# EAGLE design Stanford Metro Mini (EAGLE 8.2.2)
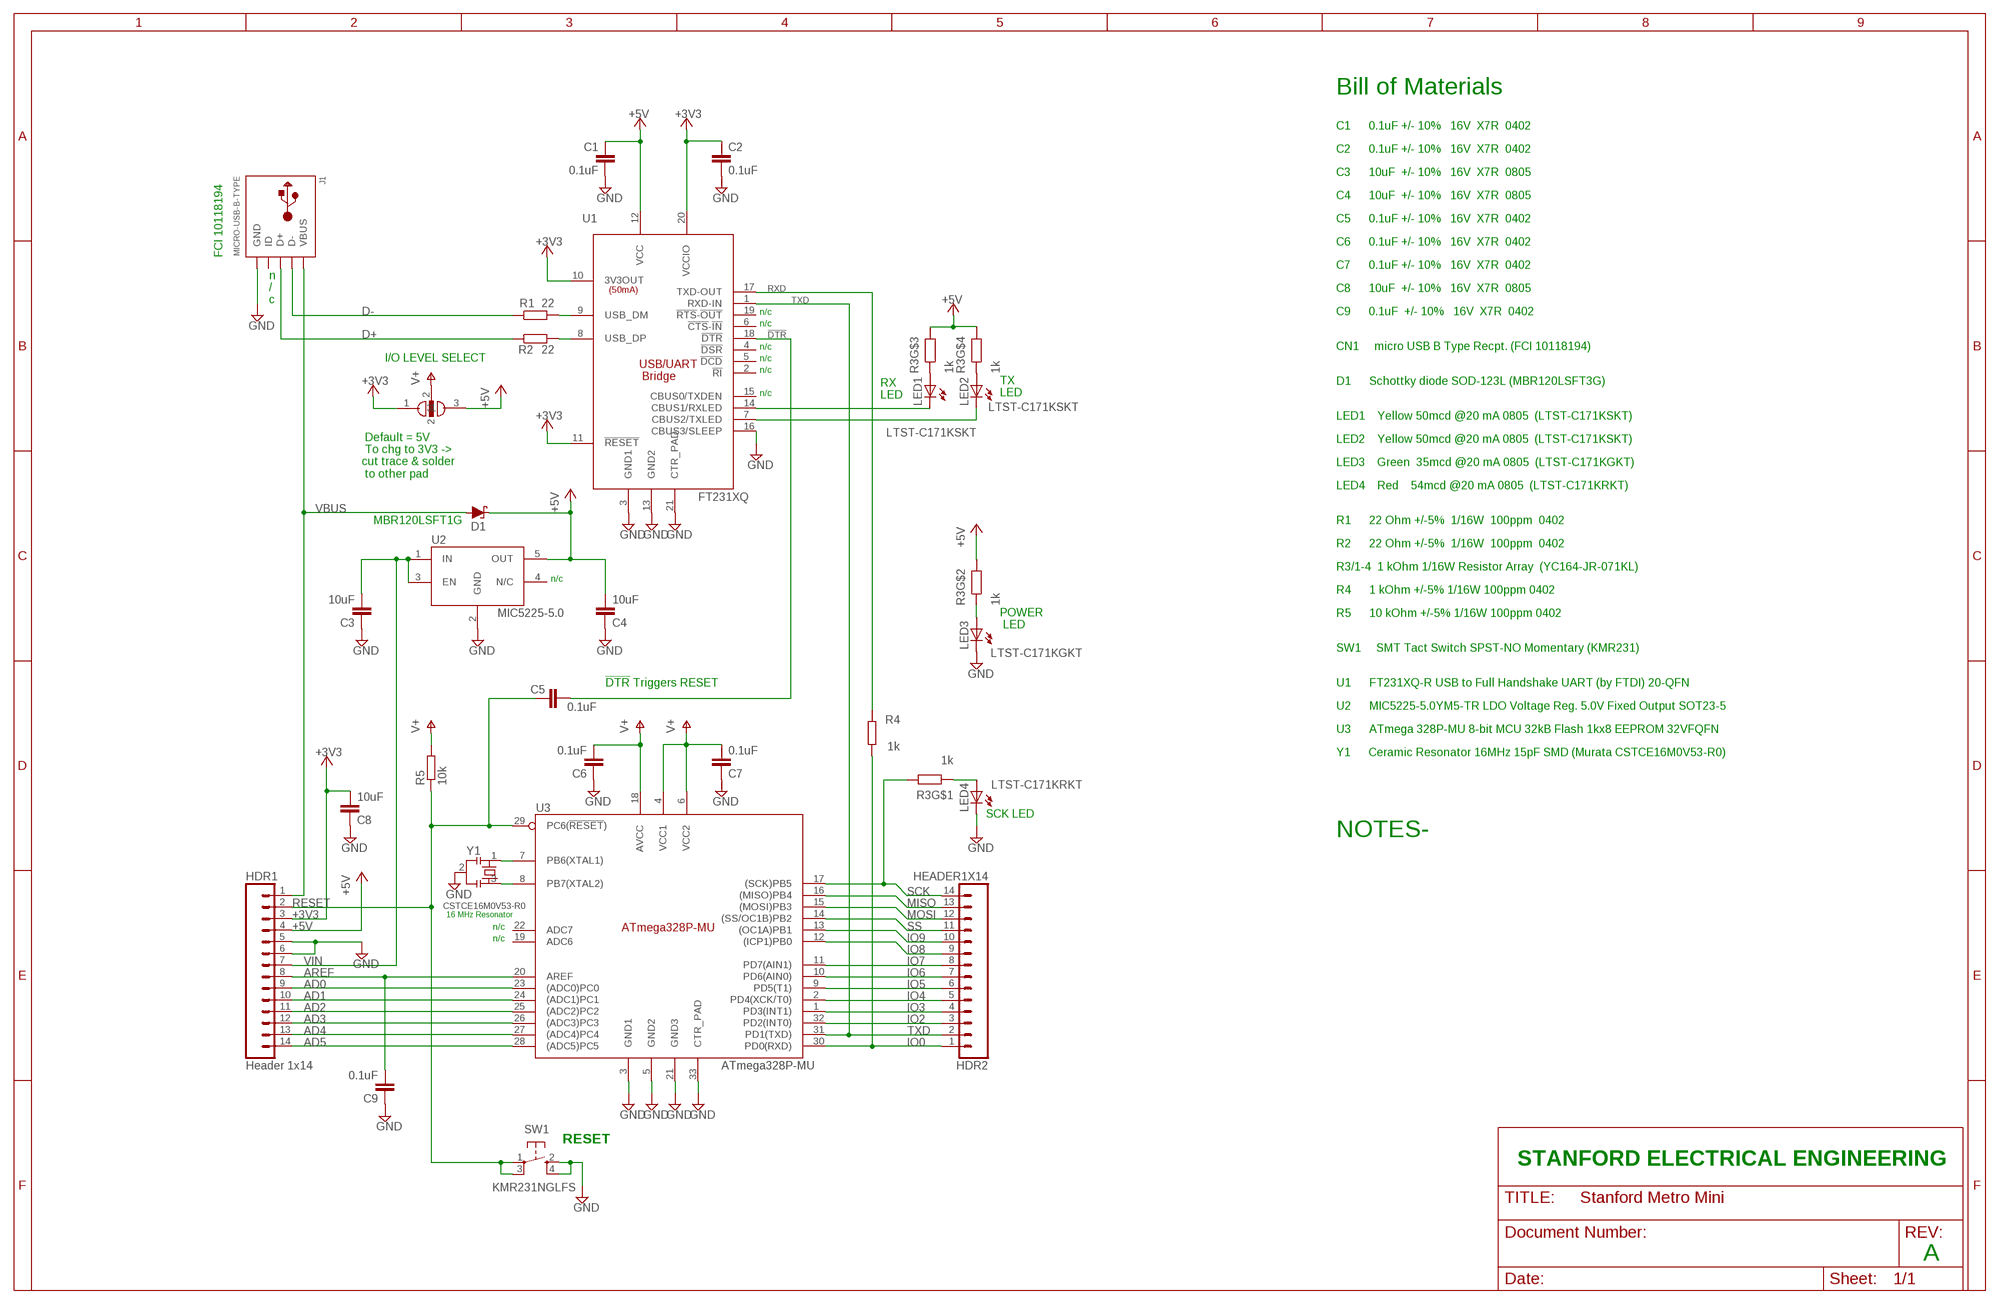
[diagram p0: schematic, sheet 1]

## Parts
C1  0.1uF  C-EUC0402  [C0402]
C2  0.1uF  C-EUC0402  [C0402]
C3  10uF  C-EUC0805  [C0805]
C4  10uF  C-EUC0805  [C0805]
C5  0.1uF  C-EUC0402  [C0402]
C6  0.1uF  C-EUC0402  [C0402]
C7  0.1uF  C-EUC0402  [C0402]
C8  10uF  C-EUC0805  [C0805]
C9  0.1uF  C-EUC0402  [C0402]
D1  SCHOTTKY  [SOD123]
HDR1  Header 1x14  HEADER1X14  [1X14]
HDR2  HEADER1X14  [1X14]
J1  MICRO-USB-B-TYPE  [10118194-MICRO-USB]
LED1  LTST-C171KSKT  LEDCHIPLED_0805  [CHIPLED_0805]
LED2  LTST-C171KSKT  LEDCHIPLED_0805  [CHIPLED_0805]
LED3  LTST-C171KGKT  LEDCHIPLED_0805  [CHIPLED_0805]
LED4  LTST-C171KRKT  LEDCHIPLED_0805  [CHIPLED_0805]
R1  22  R-EU_R0402  [R0402]
R2  22  R-EU_R0402  [R0402]
R3  1k  R-ARRAY  [R-ARRAY]
R4  1k  R-EU_R0402  [R0402]
R5  10k  R-EU_R0402  [R0402]
SW1  KMR231NGLFS  SPST_TACT-KMR2  [KMR2]
U1  FT231XQ  [QFN20]
U2  MIC5225-5.0  [SOT23-5]
U3  ATmega328P-MU  ATMEGA328P-MU  [VQFN-32_CTR-PAD]
U$1  V_SELECT  [V_SELECT]
Y1  CSTCE16M0V53-R0  CSTCE  [CSTCE]

## Nets
!DTR: C5.2 U1.18(!DTR!)
+3V3: C2.1 C8.2 HDR1.3 U1.10(3V3OUT) U1.11(!RESET!) U1.20(VCCIO) U$1.1
+5V: C1.1 C4.2 D1.1(C) HDR1.4 R3.2B(B) R3.3B(B) R3.4B(B) U1.12(VCC) U2.5(OUT) U$1.3
AD0: HDR1.9 U3.23((ADC0)PC0)
AD1: HDR1.10 U3.24((ADC1)PC1)
AD2: HDR1.11 U3.25((ADC2)PC2)
AD3: HDR1.12 U3.26((ADC3)PC3)
AD4: HDR1.13 U3.27((ADC4)PC4)
AD5: HDR1.14 U3.28((ADC5)PC5)
AREF: C9.2 HDR1.8 U3.20(AREF)
D+: J1.3(D+) R2.1
D-: J1.2(D-) R1.1
GND: C1.2 C2.2 C3.1 C4.1 C6.1 C7.1 C8.1 C9.1 HDR1.5 HDR1.6 J1.5(GND) LED3.C LED4.C SW1.2(S) SW1.4(S1) U1.3(GND1) U1.13(GND2) U1.16(CBUS3/SLEEP) U1.21(CTR_PAD) U2.2(GND) U3.3(GND1) U3.5(GND2) U3.21(GND3) U3.33(CTR_PAD) Y1.2
IO0: HDR2.1 R4.1 U3.30(PD0(RXD))
IO2: HDR2.3 U3.32(PD2(INT0))
IO3: HDR2.4 U3.1(PD3(INT1))
IO4: HDR2.5 U3.2(PD4(XCK/T0))
IO5: HDR2.6 U3.9(PD5(T1))
IO6: HDR2.7 U3.10(PD6(AIN0))
IO7: HDR2.8 U3.11(PD7(AIN1))
IO8: HDR2.9 U3.12((ICP1)PB0)
IO9: HDR2.10 U3.13((OC1A)PB1)
MISO: HDR2.13 U3.16((MISO)PB4)
MOSI: HDR2.12 U3.15((MOSI)PB3)
N$1: LED1.A R3.3A(A)
N$2: LED3.A R3.2A(A)
N$3: R1.2 U1.9(USB_DM)
N$4: R2.2 U1.8(USB_DP)
N$5: LED2.A R3.4A(A)
N$6: LED4.A R3.1A(A)
N$9: U3.7(PB6(XTAL1)) Y1.1
N$10: U3.8(PB7(XTAL2)) Y1.3
RESET: C5.1 HDR1.2 R5.1 SW1.1(P) SW1.3(P1) U3.29(PC6(!RESET!))
RX_LED: LED1.C U1.14(CBUS1/RXLED)
RXD: R4.2 U1.17(TXD-OUT)
SCK: HDR2.14 R3.1B(B) U3.17((SCK)PB5)
SS: HDR2.11 U3.14((SS/OC1B)PB2)
TX_LED: LED2.C U1.7(CBUS2/TXLED)
TXD: HDR2.2 U1.1(RXD-IN) U3.31(PD1(TXD))
V+: C6.2 C7.2 R5.2 U3.4(VCC1) U3.6(VCC2) U3.18(AVCC) U$1.2
VBUS: D1.2(A) HDR1.1 J1.1(VBUS)
VIN: C3.2 HDR1.7 U2.1(IN) U2.3(EN)
Unconnected: J1.4(ID) U1.2(!RI!) U1.4(!DSR!) U1.5(!DCD!) U1.6(!CTS!-!IN!) U1.15(CBUS0/TXDEN) U1.19(!RTS!-!OUT!) U2.4(N/C) U3.19(ADC6) U3.22(ADC7)

## Notes on the sheet
- Bill of Materials
- C1      0.1uF +/- 10%   16V  X7R  0402
- C2      0.1uF +/- 10%   16V  X7R  0402
- C3      10uF  +/- 10%   16V  X7R  0805
- C4      10uF  +/- 10%   16V  X7R  0805
- C5      0.1uF +/- 10%   16V  X7R  0402
- C6      0.1uF +/- 10%   16V  X7R  0402
- FCI 10118194
- C7      0.1uF +/- 10%   16V  X7R  0402
- C8      10uF  +/- 10%   16V  X7R  0805
- n
  /
  c
- n/c | C9      0.1uF  +/- 10%   16V  X7R  0402
- n/c
- n/c | CN1     micro USB B Type Recpt. (FCI 10118194)
- I/O LEVEL SELECT | n/c
- n/c
- D1      Schottky diode SOD-123L (MBR120LSFT3G)
- n/c
- TX
  LED
- RX
  LED
- LED1    Yellow 50mcd @20 mA 0805  (LTST-C171KSKT)
- LED2    Yellow 50mcd @20 mA 0805  (LTST-C171KSKT)
- LED3    Green  35mcd @20 mA 0805  (LTST-C171KGKT)
- Default = 5V
   To chg to 3V3 ->
  cut trace & solder
   to other pad
- LED4    Red    54mcd @20 mA 0805  (LTST-C171KRKT)
- MBR120LSFT1G | R1      22 Ohm +/-5%  1/16W  100ppm  0402
- R2      22 Ohm +/-5%  1/16W  100ppm  0402
- R3/1-4  1 kOhm 1/16W Resistor Array  (YC164-JR-071KL)
- n/c
- R4      1 kOhm +/-5% 1/16W 100ppm 0402
- R5      10 kOhm +/-5% 1/16W 100ppm 0402
- POWER
   LED
- SW1     SMT Tact Switch SPST-NO Momentary (KMR231)
- !DTR! Triggers RESET | U1      FT231XQ-R USB to Full Handshake UART (by FTDI) 20-QFN
- U2      MIC5225-5.0YM5-TR LDO Voltage Reg. 5.0V Fixed Output SOT23-5
- U3      ATmega 328P-MU 8-bit MCU 32kB Flash 1kx8 EEPROM 32VFQFN
- Y1      Ceramic Resonator 16MHz 15pF SMD (Murata CSTCE16M0V53-R0)
- SCK LED
- NOTES-
- 16 MHz Resonator
- n/c
- n/c
- RESET
- STANFORD ELECTRICAL ENGINEERING
- A

## Library data of the parts
C1-C9 = Stanford Metro Mini:C-EU: CAPACITOR, European symbol
D1 = Stanford Metro Mini:SCHOTTKY: Schottky diode
HDR1 HDR2 = Stanford Metro Mini:HEADER1X14: 14-pin header with pins spaced 0.1" apart
J1 = Stanford Metro Mini:MICRO-USB-B-TYPE
LED1-LED4 = Stanford Metro Mini:LED: LED OSRAM: - CHIPLED LG R971, LG N971, LY N971, LG Q971, LY Q971, LO R971, LY R971 LH N974, LH R974 LS Q976, LO Q976, LY Q976 LO Q996 - Hyper CHIPLED LW Q18S LB Q993, LB Q99A, LB R99A - SideLED LS A670, LO A670, LY A670, LG A670, LP A670 LB A673, LV A673, LT A673, LW A673 LH A674 LY A675 LS A676, LA A676, LO A676, LY A676, LW A676 LS A679, LY A679, LG A679 - Hyper Micro SIDELED® LS Y876, LA Y876, LO Y876, LY Y876 LT Y87S - SmartLED LW L88C, LW L88S LB L89C, LB L89S, LG L890 LS L89K, LO L89K, LY L89K LS L896, LA L896, LO L896, LY L896 - TOPLED LS T670, LO T670, LY T670, LG T670, LP T670 LSG T670, LSP T670, LSY T670, LOP T670, LYG T670 LG T671, LOG T671, LSG T671 LB T673, LV T673, LT T673, LW T673 LH T674 LS T676, LA T676, LO T676, LY T676, LB T676, LH T676, LSB T676, LW T676 LB T67C, LV T67C, LT T67C, LS T67K, LO T67K, LY T67K, LW E67C LS E67B, LA E67B, LO E67B, LY E67B, LB E67C, LV E67C, LT E67C LW T67C LS T679, LY T679, LG T679 LS T770, LO T770, LY T770, LG T770, LP T770 LB T773, LV T773, LT T773, LW T773 LH T774 LS E675, LA E675, LY E675, LS T675 LS T776, LA T776, LO T776, LY T776, LB T776 LHGB T686 LT T68C, LB T68C - Hyper Mini TOPLED® LB M676 - Mini TOPLED Santana® LG M470 LS M47K, LO M47K, LY M47K Source: http://www.osram.convergy.de LUXEON: - LUMILED® LXK2-PW12-R00, LXK2-PW12-S00, LXK2-PW14-U00, LXK2-PW14-V00 LXK2-PM12-R00, LXK2-PM12-S00, LXK2-PM14-U00 LXK2-PE12-Q00, LXK2-PE12-R00, LXK2-PE12-S00, LXK2-PE14-T00, LXK2-PE14-U00 LXK2-PB12-K00, LXK2-PB12-L00, LXK2-PB12-M00, LXK2-PB14-N00, LXK2-PB14-P00, LXK2-PB14-Q00 LXK2-PR12-L00, LXK2-PR12-M00, LXK2-PR14-Q00, LXK2-PR14-R00 LXK2-PD12-Q00, LXK2-PD12-R00, LXK2-PD12-S00 LXK2-PH12-R00, LXK2-PH12-S00 LXK2-PL12-P00, LXK2-PL12-Q00, LXK2-PL12-R00 Source: www.luxeon.com KINGBRIGHT: KA-3528ASYC Source: www.kingbright.com
R1 R2 R4 R5 = Stanford Metro Mini:R-EU_: RESISTOR, European symbol
R3 = Stanford Metro Mini:R-ARRAY
SW1 = Stanford Metro Mini:SPST_TACT: SMT 6mm switch, EVQQ2 series http://www.ladyada.net/library/eagle
U1 = Stanford Metro Mini:FT231XQ: FT231XQ - USB to Full Handshake UART IC Notes: USB 2.0 Compatible Vcc: 3.3 V and 5 V compatible Operating Temperature Range: -40°C to +85°C
U2 = Stanford Metro Mini:MIC5225-5.0: MIC5225-5.0YM5 Low Drop Out 5.0V Regulator
U3 = Stanford Metro Mini:ATMEGA328P-MU: ATmega328P-RU Notes: This is the 32MLF / 32M1-A package There is a center pad which must be connected to ground (hence pin 33!) This is distinct from the 328P-AU!
U$1 = Stanford Metro Mini:V_SELECT
Y1 = Stanford Metro Mini:CSTCE: SMD resonator from Murata (CSTCE16M0V53-S0)

## Board
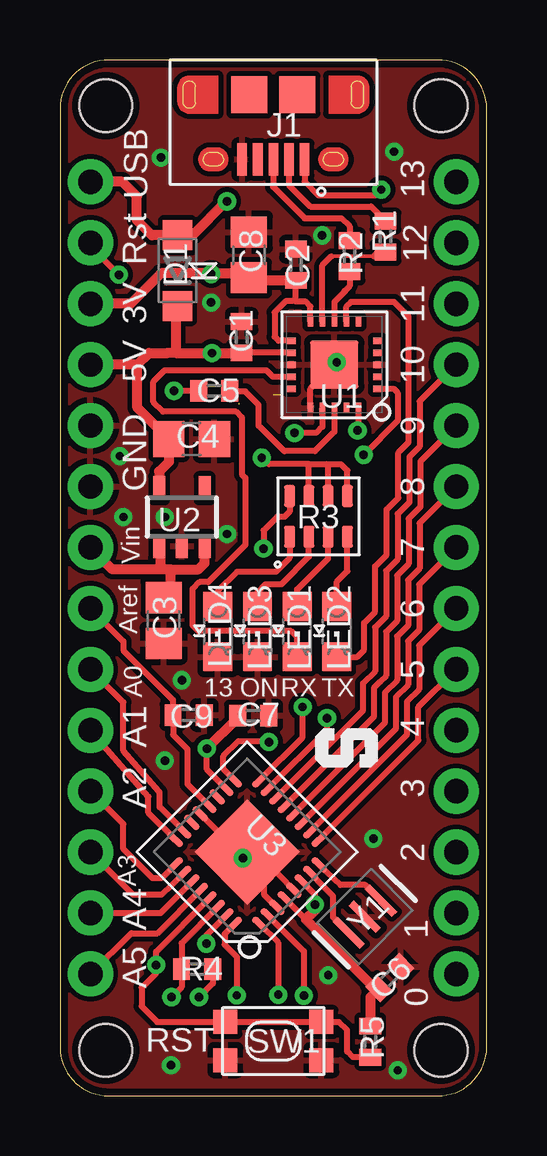
[diagram p1: board, top side]
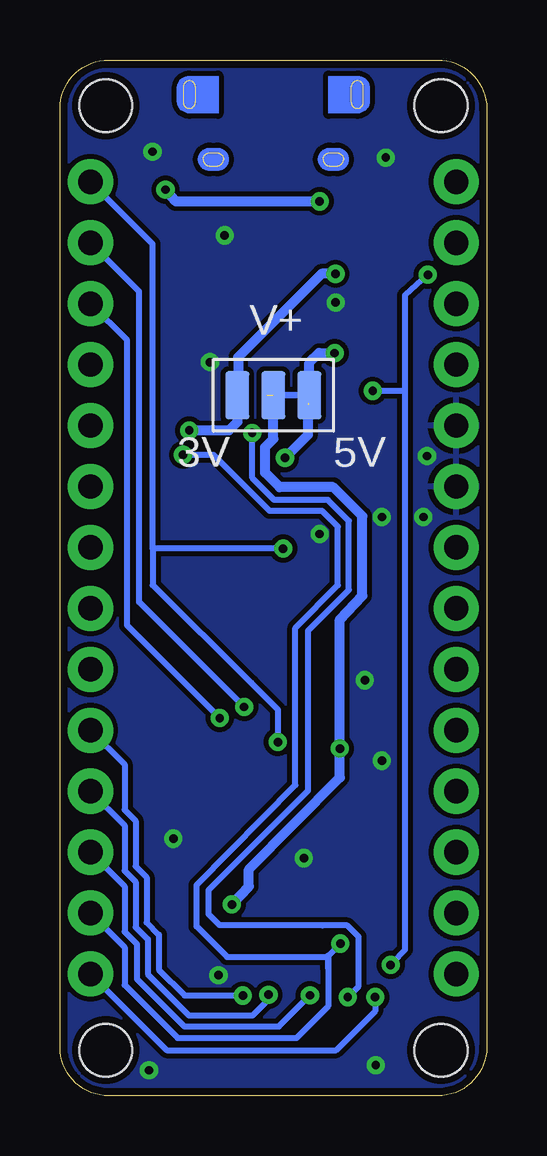
[diagram p2: board, bottom side, seen from below]

Size 17.78 x 43.18 mm. Coordinates in mm from the lower left corner, seen from the top.
Outline: 2.03,0 15.75,0 arc90 17.78,2.03 17.78,41.15 arc90 15.75,43.18 2.03,43.18 arc90 0,41.15 0,2.03 arc90 2.03,0
Copper layers (1*16): Top 0.035mm / dielectric 1.5mm / Bottom 0.035mm
Design rules "default *": minimum track width 6mil, minimum drill 12mil, track to track 8mil, track to pad 8mil, pad to pad 8mil, via to via 8mil, smd to smd 8mil, copper to edge 12mil, drill to drill 8mil, minimum pad ring 10mil, minimum via ring 8mil, stop-mask expansion 4mil, vias tented up to drill 14mil, thermal gap 10mil
Holes 2.2 mm at 1.91,41.27 1.91,1.91 15.88,41.27 15.88,1.91

### Footprints (pad centres in the part's own frame; a part is rotated, then mirrored left to right if it is on the bottom)
C0402 = smd 0.7 x 0.9: 1 -0.65,0; 2 0.65,0
C0805 = smd 1.3 x 1.5: 1 -0.95,0; 2 0.95,0
SOD123 = smd 1.25 x 1.22: 1 -1.475,0; 2 1.475,0
1X14 = drill 1.016 pad 1.88: 1 0,0; 2 2.54,0; 3 5.08,0; 4 7.62,0; 5 10.16,0; 6 12.7,0; 7 15.24,0; 8 17.78,0; 9 20.32,0; 10 22.86,0; 11 25.4,0; 12 27.94,0; 13 30.48,0; 14 33.02,0
10118194-MICRO-USB = smd 0.4 x 1.35: 1 -1.3,1.35; 2 -0.65,1.35; 3 0,1.35; 4 0.65,1.35; 5 1.3,1.35 | smd 1.5 x 1.55: P$1 -1,-1.35; P$2 1,-1.35
CHIPLED_0805 = smd 1.2 x 1.2: A 0,-1.05; C 0,1.05
R0402 = smd 0.7 x 0.9: 1 -0.65,0; 2 0.65,0
R-ARRAY = smd 0.45 x 0.9: 1A 1.2,0.85; 1B 1.2,-0.85; 2A 0.4,0.85; 2B 0.4,-0.85; 3A -0.4,0.85; 3B -0.4,-0.85; 4A -1.2,0.85; 4B -1.2,-0.85
KMR2 = smd 1 x 1: 1 2,0.8; 2 2,-0.8; 3 -2,0.8; 4 -2,-0.8
QFN20 = smd 0.4 x 0.25: 1 -1.8,1; 2 -1.8,0.5; 3 -1.8,0; 4 -1.8,-0.5; 5 -1.8,-1; 11 1.8,-1; 12 1.8,-0.5; 13 1.8,0; 14 1.8,0.5; 15 1.8,1 | smd 0.25 x 0.4: 6 -1,-1.8; 7 -0.5,-1.8; 8 0,-1.8; 9 0.5,-1.8; 10 1,-1.8; 16 1,1.8; 17 0.5,1.8; 18 0,1.8; 19 -0.5,1.8; 20 -1,1.8 | smd 2 x 2: 21 0,0
SOT23-5 = smd 0.5 x 1: 1 -0.95,-1.2; 2 0,-1.2; 3 0.95,-1.2; 4 0.95,1.2; 5 -0.95,1.2
VQFN-32_CTR-PAD = smd 0.8 x 0.3: 1 -2.5,1.75; 2 -2.5,1.25; 3 -2.5,0.75; 4 -2.5,0.25; 5 -2.5,-0.25; 6 -2.5,-0.75; 7 -2.5,-1.25; 8 -2.5,-1.75; 17 2.5,-1.75; 18 2.5,-1.25; 19 2.5,-0.75; 20 2.5,-0.25; 21 2.5,0.25; 22 2.5,0.75; 23 2.5,1.25; 24 2.5,1.75 | smd 0.3 x 0.8: 9 -1.75,-2.5; 10 -1.25,-2.5; 11 -0.75,-2.5; 12 -0.25,-2.5; 13 0.25,-2.5; 14 0.75,-2.5; 15 1.25,-2.5; 16 1.75,-2.5; 25 1.75,2.5; 26 1.25,2.5; 27 0.75,2.5; 28 0.25,2.5; 29 -0.25,2.5; 30 -0.75,2.5; 31 -1.25,2.5; 32 -1.75,2.5 | smd 3.1 x 3.1: 33 0,0
V_SELECT = smd 1 x 2: 1 -1.5,0; 2 0,0; 3 1.5,0
CSTCE = smd 0.3 x 1.6: 1 -0.95,0; 2 0,0; 3 0.95,0

### Placement (x,y rotation side)
C1  7.57,31.62 90 top
C2  9.83,34.65 90 top
C3  4.32,19.81 90 top
C4  5.49,27.38 180 top
C5  6.43,29.39 0 top
C6  13.74,4.93 225 top
C7  8.05,15.85 180 top
C8  7.87,35.05 270 top
C9  5.36,15.88 180 top
D1  4.9,34.4 90 top
HDR1  1.27,38.1 270 top
HDR2  16.51,5.08 90 top
J1  8.89,40.39 180 top
LED1  9.88,19.35 180 top
LED2  11.53,19.35 180 top
LED3  8.23,19.35 180 top
LED4  6.58,19.35 180 top
R1  13.56,35.81 270 top
R2  12.06,35 270 top
R3  10.77,24.16 180 top
R4  5.71,5.28 0 top
R5  12.93,2.26 90 top
SW1  8.89,2.29 0 top
U1  11.43,30.48 180 top
U2  5.08,24.13 0 top
U3  7.8,10.16 135 top
U$1  8.89,29.21 0 bottom
Y1  12.7,7.47 45 top

### Tracks (layer width: path | path; a pad name or v marks a point on that pad's centre or on a via)
!DTR
  Top 0.254: U1.18 11.43,27.69 10.62,26.87 9.35,26.87 8.28,27.94 8.28,28.8 7.72,29.36 6.96,29.36 6.93,29.39 C5.2
+3V3  (via drill 0.35)
  Top 0.254: U1.10 10.43,32.9 10.21,33.12 9.81,33.12 | 6.58,34.29 v6.3,34.27 6.38,34.29 | U1.11 9.11,31.48 8.94,31.65 8.94,32.66 9.4,33.12 9.81,33.12 | U1.20 12.43,27.77 v12.39,27.74 | C2.1 9.81,33.98 9.81,33.12
  Top 0.406: 6.38,34.29 4.22,34.29 2.95,33.02 HDR1.3 | v6.3,34.27 7.71,34.27 C8.2 7.98,34 C2.1
  Bottom 0.254: 10.36,29.24 U$1.1 | 12.42,27.74 v12.39,27.74 12.42,27.71 12.45,27.71 12.42,27.74
  Bottom 0.406: 10.36,29.24 10.36,30.79 6.88,34.27 v6.3,34.27 | U$1.1 10.39,28.09 10.74,27.74 v12.39,27.74
+5V  (via drill 0.35)  (1 unrouted)
  Top 0.254: U1.12 C1.1 | 4.85,30.98 4.48,30.96 | 11.1,26.33 11.7,26.33 11.97,26.07 R3.4B | 10.38,26.33 11.1,26.33 | 10.38,26.33 8.72,26.33 v8.41,26.59 | R3.3B 11.17,26.32 11.1,26.33 | R3.2B 10.37,26.32 10.38,26.33
  Top 0.406: 3.23,30.48 HDR1.4 | 3.23,30.48 3.71,30.96 4.48,30.96 4.82,30.96 | C1.1 v6.34,30.96 4.82,30.96 | 3.23,30.48 3.23,28.69 C4.2 4.53,26.43 4.13,26.02 U2.5 | D1.1 4.82,32.84 4.82,30.96
  Bottom 0.254: U$1.3
  Bottom 0.406: U$1.3 7.39,30.56 6.99,30.96 v6.34,30.96 | 7.44,28.89 7.39,28.94 U$1.3 | v8.41,26.59 7.44,27.56 7.44,28.81
AD0
  Top 0.254: U3.23 4.15,12.04 4.15,12.65 4.14,12.66 2.64,14.38 2.64,16.41 HDR1.9
AD1
  Top 0.254: HDR1.10 3.68,12.47 3.68,11.8 U3.24 4.79,10.67
AD2
  Top 0.254: U3.25 4.23,9.07 3.86,9.07 2.64,10.29 2.64,11.33 HDR1.11
AD3
  Top 0.254: U3.26 4.23,8.38 3.05,8.38 HDR1.12
AD4
  Top 0.254: U3.27 4.2,7.62 HDR1.13
AD5
  Top 0.254: HDR1.14 2.97,6.78 4.07,6.78 U3.28
AREF
  Top 0.254: U3.20 5.31,13 5.31,14.45 4.71,15.05 C9.2 4.7,16.51 2.64,18.57 2.64,18.95 HDR1.8
D+
  Top 0.254: J1.3 8.88,39.17 8.88,37.89 10.19,36.58 11.73,36.58 12.06,36.25 R2.1
D-
  Top 0.254: J1.2 9.53,39.17 9.53,37.97 10.44,37.07 12.96,37.07 R1.1
GND  (via drill 0.35)
  Top 0.254: U3.33 8.54,10.16 8.54,9.98 | U3.3 8.51,8.39 8.51,8.84 8.54,9.27 8.54,9.98 | U3.5 8.58,9.78 8.54,9.98 | v11.53,30.58 11.81,30.86 11.81,31.04 11.43,30.66 v11.53,30.58 | U1.16 10.43,29.48 v11.53,30.58 | U3.21 6.58,11.02 6.66,11.02
  other vias: 13.06,10.72 4.21,39.11 13.92,39.36 6.3,33.07 10.92,35.86 2.64,24.13 2.49,26.67 4.37,24.13 6.96,23.42 5.08,17.32 4.37,13.97 4.62,1.28 14.07,1.07 11.18,5.03 7.62,9.91
  pour Top: 0,0 17.78,0 17.78,43.18 0,43.18
  pour Bottom: 0,0 17.78,0 17.78,43.18 0,43.18
IO0  (via drill 0.35)
  Top 0.254: U3.30 5.07,6.37 R4.1 5.07,4.53 v4.65,4.12
  Bottom 0.254: v4.65,4.12 4.65,3.53 6.27,1.91 13.34,1.91 HDR2.1
IO2  (via drill 0.35)
  Top 0.254: U3.32 6.86,6.75 6.86,6.3 7.37,5.79 v7.37,4.19
  Bottom 0.254: v7.37,4.19 8.66,2.9 12.6,2.9 14.58,4.88 14.58,6.34 15.09,6.84 15.09,8.74 HDR2.3
IO3  (via drill 0.35)
  Top 0.254: U3.1 9.09,6.39 v9.09,4.21
  Bottom 0.254: v9.09,4.21 9.09,4.01 9.75,3.35 12.41,3.35 14.12,5.07 14.12,6.53 14.63,7.03 14.63,8.93 15.09,9.38 15.09,11.28 HDR2.4
IO4  (via drill 0.35)
  Top 0.254: U3.2 10.16,6.03 v10.16,4.18
  Bottom 0.254: v10.16,4.18 12.59,4.18 13.66,5.26 13.66,6.71 14.17,7.22 14.17,9.12 14.63,9.57 14.63,11.47 15.09,11.92 15.09,13.82 HDR2.5
IO5
  Top 0.254: U3.9 14.94,14.82 14.94,16.2 HDR2.6
IO6
  Top 0.254: U3.10 14.45,15.05 14.45,16.43 14.96,16.94 14.96,18.77 HDR2.7
IO7
  Top 0.254: U3.11 13.99,15.3 13.99,16.62 14.5,17.13 14.5,18.96 14.96,19.42 14.96,21.31 HDR2.8
IO8
  Top 0.254: HDR2.9 14.99,23.88 14.99,21.98 14.5,21.5 14.5,19.61 14.05,19.15 14.05,17.32 13.54,16.81 13.54,15.55 U3.12
IO9
  Top 0.254: HDR2.10 15.01,26.44 15.01,24.55 14.53,24.07 14.53,22.17 14.05,21.69 14.05,19.8 13.59,19.34 13.59,17.51 13.35,17.27 | 13.35,17.27 | 13.35,17.27 13.08,17 13.08,15.8 U3.13
MISO  (via drill 0.35)
  Top 0.254: U3.16 10.11,14.95 v10.11,16.21
  Bottom 0.254: v10.11,16.21 14.48,20.58 14.48,33.53 HDR2.13
MOSI  (via drill 0.35)
  Top 0.254: U3.15 11.12,15.26 v11.12,15.75
  Bottom 0.254: v11.12,15.75 14.99,19.61 14.99,31.5 HDR2.12
N$1
  Top 0.254: LED1.A 9.88,21.11 11.17,22.4 R3.3A
N$2
  Top 0.254: LED3.A 8.23,21.01 8.56,21.34 9.23,21.34 10.37,22.47 R3.2A
N$3
  Top 0.152: 11.31,35 13.08,35
  Top 0.254: R1.2 13.24,35.16 13.08,35 | U1.9 10.93,34.62 11.31,35
N$4
  Top 0.254: R2.2 12.06,33.76 11.86,33.55 11.89,33.55 11.43,33.1 U1.8
N$5
  Top 0.254: R3.4A 11.97,21.88 11.53,21.44 LED2.A
N$6
  Top 0.254: R3.1A 9.57,22.42 8.99,21.84 7.37,21.84 6.58,21.06 LED4.A
N$9
  Top 0.254: U3.7 10.75,8.94 11.38,8.32 11.38,7.45 Y1.1
N$10
  Top 0.254: Y1.3 12.72,8.79 11.7,8.79 U3.8
RESET  (via drill 0.35)
  Top 0.254: C5.1 v4.75,29.39 | U3.29 4,6.01 v4,5.46 4,5.1 3.4,4.5 3.4,3.73 4.05,3.09 SW1.3 SW1.1 11.62,3.09 11.96,2.74 11.96,1.85 12.21,1.61 R5.1 | v2.45,34.23 1.32,35.36 HDR1.2
  Bottom 0.254: v4,5.46 3.94,5.55 3.4,6.1 3.4,6.3 3.4,29.39 | 3.4,29.39 v4.75,29.39 | v2.45,34.23 3.4,33.38 3.4,29.39
RX_LED
  Top 0.254: LED1.C 9.88,19.12 9.63,19.37 5.77,19.37 5.52,19.62 5.52,21.13 5.8,21.41 6.17,21.41 7.72,22.96 7.72,25.76 7.58,25.9 7.58,28.28 7.33,28.52 4.3,28.52 3.89,28.92 3.89,29.78 4.36,30.25 8.6,30.25 8.87,29.98 U1.14
RXD  (via drill 0.35)
  Top 0.254: 5.74,4.22 5.79,4.17 v5.79,4.12 6.37,4.69 R4.2 | 10.93,28.39 U1.17 10.93,27.9 10.67,27.64 v9.77,27.64 v9.77,27.63
  Bottom 0.254: v5.79,4.12 5.33,4.57 5.33,6.64 5.8,7.11 6.85,7.11 6.84,7.11 11.12,7.11 11.58,7.57 11.58,8.59 7.44,12.72 7.44,19.39 5.74,21.1 5.74,23.96 6.62,24.84 8.85,24.84 9.77,25.76 v9.77,27.63
SCK  (via drill 0.35)
  Top 0.254: U3.17 6.81,13.62 6.81,14.16 7.43,14.78 8.74,14.78 v8.7,14.75 | R3.1B 9.57,24.35 9.35,24.13 9.04,24.13 8.48,23.57 v8.48,22.81
  Bottom 0.254: 13.92,22.8 13.92,21.29 9.8,17.22 9.82,17.22 8.7,16.1 v8.7,14.75 | 13.92,22.8 13.92,28.21 13.92,28.2 13.92,35.51 HDR2.14 | v8.48,22.81 v8.48,22.8 13.92,22.8
SS
  Top 0.254: U3.14 12.62,16.05 12.62,17.19 13.13,17.7 13.13,19.53 13.59,19.98 13.59,21.88 14.07,22.36 14.07,24.25 14.55,24.74 14.55,26.63 14.99,27.06 14.99,28.96 HDR2.11
TX_LED
  Top 0.254: U1.7 11.93,32.9 12.13,33.1 13.92,33.1 14.53,32.49 14.53,27.25 14.1,26.82 14.1,24.93 13.61,24.44 13.61,22.55 13.13,22.07 13.13,20.18 12.68,19.72 12.68,18.59 12.39,18.3 LED2.C
TXD  (via drill 0.35)
  Top 0.254: U3.31 6.1,6.69 v6.1,6.34 v6.1,6.35 | v12.65,26.72 14.07,28.14 14.07,29.31 13.9,29.48 U1.1
  Bottom 0.254: v6.1,6.35 6.6,5.84 6.6,5.33 | 6.6,5.33 6.6,3.73 7.92,2.41 12.88,2.41 15.09,4.62 15.09,6.2 HDR2.2 | 6.6,5.33 6.6,5.79 10.82,5.79 12.09,7.06 12.09,8.79 7.98,12.95 7.98,19.51 6.2,21.29 6.2,23.72 6.86,24.38 9.04,24.38 11.38,26.72 v12.65,26.72
V+  (via drill 0.35)  (1 unrouted)
  Top 0.254: v6.12,14.48 6.12,13.6 U3.18 | U3.4 10.25,7.35 | 13.14,4.47 C6.2 | 10.62,7.72 v10.62,7.98 10.62,8.4 U3.6 | 7.4,15.76 C7.2
  Top 0.406: 13.14,4.47 10.25,7.35 10.62,7.72 | C6.2 12.93,4.12 R5.2 | v6.12,14.48 7.4,15.76
  Bottom 0.406: v10.62,7.98 9.91,8.74 9.91,9.44 6.12,13.27 v6.12,14.48 6.12,19.86 5.18,20.86 5.18,24.16 6.4,25.38 8.63,25.38 9.24,25.98 9.24,27.04 8.89,27.38 8.89,28.64 9.17,28.91 9.17,29.21
VBUS  (via drill 0.35)
  Top 0.254: J1.1 10.19,38.12 10.77,37.54 13.15,37.54 v13.39,37.77
  Top 0.406: v6.96,37.29 6.93,37.29 5.52,35.88 D1.2 3.83,35.88 3.2,36.5 3.2,37.5 2.6,38.1 HDR1.1
  Bottom 0.406: v13.39,37.77 12.95,37.29 v6.96,37.29
VIN
  Top 0.254: U2.1 4.18,22.88 | C3.2 4.61,21.06
  Top 0.406: HDR1.7 2.18,21.95 4.18,21.95 | 4.61,21.95 4.18,21.95 | 4.61,21.95 5.77,21.95 6.03,22.21 U2.3 | 4.18,22.88 4.18,21.95 | 4.61,21.06 4.61,21.95

### Text on the board
tPlace: USB | 13 | Rst | 12 | 3V | 11 | 5V | 10 | 9 | GND | 8 | Vin | 7 | Aref | 6 | 5 | A0 | 13 | ON | RX | TX | A1 | 4 | A2 | 3 | 2 | A3 | A4 | 1 | A5 | 0 | RST
tNames: SW1